# Altium schematic sheet FPGA.SchDoc
size A3; Organization: Blinkinlabs, LLC
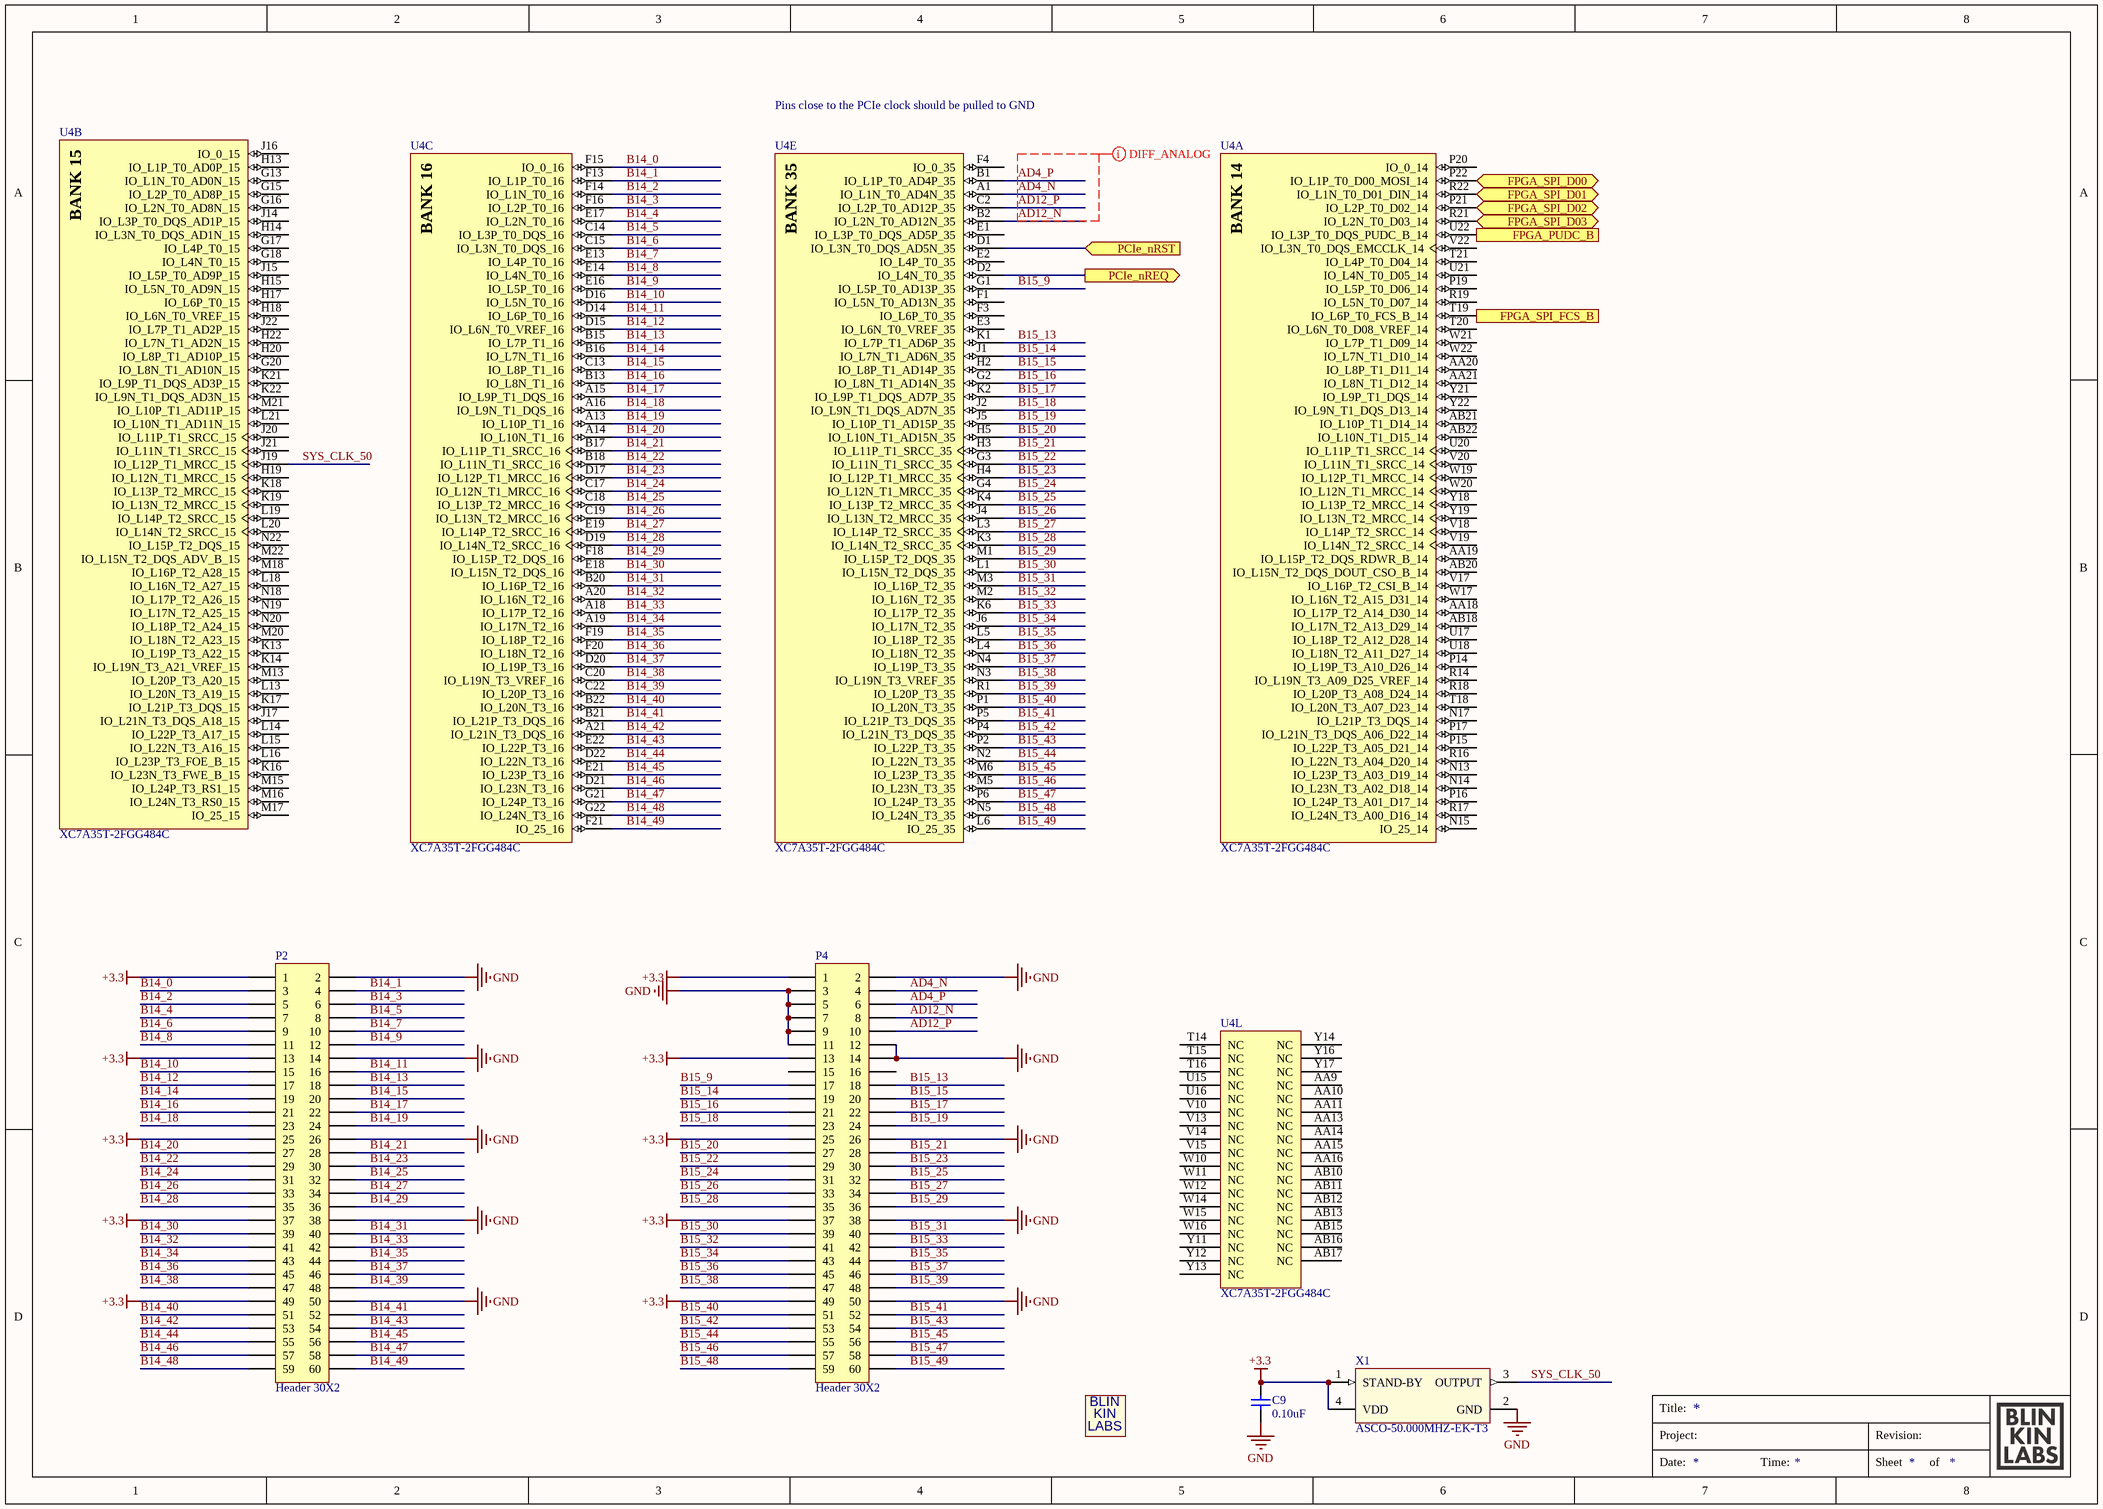
[diagram p0: FPGA.SchDoc]

## Parts
C9  0.10uF  [CAPC1005X06L]
L1  BLINKINLABS_LOGO  [BLINKINLABS_LOGO]  (value not drawn)  (no BOM)
P2  Header 30X2  [HDR2X30]
P4  Header 30X2  [HDR2X30]
U4  XC7A35T-2FGG484C  [FGG484]  (parts A,B,C,E,L of 12)
X1  ASCO-50.000MHZ-EK-T3  [ABRA-ASCO-50.000MHZ-EK-T3-4_V]

## Ports
FPGA_PUDC_B (in), FPGA_SPI_D00 (bidir), FPGA_SPI_D01 (bidir), FPGA_SPI_D02 (bidir), FPGA_SPI_D03 (bidir), FPGA_SPI_FCS_B (out), PCIe_nREQ (out), PCIe_nRST (in)

## Nets
+3.3: C9.2 P2.1 P2.13 P2.25 P2.37 P2.49 P4.1 P4.13 P4.25 P4.37 P4.49 X1.1(STAND-BY) X1.4(VDD)
GND: C9.1 P2.2 P2.14 P2.26 P2.38 P2.50 P4.2 P4.3 P4.5 P4.7 P4.9 P4.11 P4.12 P4.14 P4.26 P4.38 P4.50 X1.2(GND)
AD4_N: P4.4 U4.A1(IO_L1N_T0_AD4N_35)
AD4_P: P4.6 U4.B1(IO_L1P_T0_AD4P_35)
AD12_N: P4.8 U4.B2(IO_L2N_T0_AD12N_35)
AD12_P: P4.10 U4.C2(IO_L2P_T0_AD12P_35)
B14_0: P2.3 U4.F15(IO_0_16)
B14_1: P2.4 U4.F13(IO_L1P_T0_16)
B14_2: P2.5 U4.F14(IO_L1N_T0_16)
B14_3: P2.6 U4.F16(IO_L2P_T0_16)
B14_4: P2.7 U4.E17(IO_L2N_T0_16)
B14_5: P2.8 U4.C14(IO_L3P_T0_DQS_16)
B14_6: P2.9 U4.C15(IO_L3N_T0_DQS_16)
B14_7: P2.10 U4.E13(IO_L4P_T0_16)
B14_8: P2.11 U4.E14(IO_L4N_T0_16)
B14_9: P2.12 U4.E16(IO_L5P_T0_16)
B14_10: P2.15 U4.D16(IO_L5N_T0_16)
B14_11: P2.16 U4.D14(IO_L6P_T0_16)
B14_12: P2.17 U4.D15(IO_L6N_T0_VREF_16)
B14_13: P2.18 U4.B15(IO_L7P_T1_16)
B14_14: P2.19 U4.B16(IO_L7N_T1_16)
B14_15: P2.20 U4.C13(IO_L8P_T1_16)
B14_16: P2.21 U4.B13(IO_L8N_T1_16)
B14_17: P2.22 U4.A15(IO_L9P_T1_DQS_16)
B14_18: P2.23 U4.A16(IO_L9N_T1_DQS_16)
B14_19: P2.24 U4.A13(IO_L10P_T1_16)
B14_20: P2.27 U4.A14(IO_L10N_T1_16)
B14_21: P2.28 U4.B17(IO_L11P_T1_SRCC_16)
B14_22: P2.29 U4.B18(IO_L11N_T1_SRCC_16)
B14_23: P2.30 U4.D17(IO_L12P_T1_MRCC_16)
B14_24: P2.31 U4.C17(IO_L12N_T1_MRCC_16)
B14_25: P2.32 U4.C18(IO_L13P_T2_MRCC_16)
B14_26: P2.33 U4.C19(IO_L13N_T2_MRCC_16)
B14_27: P2.34 U4.E19(IO_L14P_T2_SRCC_16)
B14_28: P2.35 U4.D19(IO_L14N_T2_SRCC_16)
B14_29: P2.36 U4.F18(IO_L15P_T2_DQS_16)
B14_30: P2.39 U4.E18(IO_L15N_T2_DQS_16)
B14_31: P2.40 U4.B20(IO_L16P_T2_16)
B14_32: P2.41 U4.A20(IO_L16N_T2_16)
B14_33: P2.42 U4.A18(IO_L17P_T2_16)
B14_34: P2.43 U4.A19(IO_L17N_T2_16)
B14_35: P2.44 U4.F19(IO_L18P_T2_16)
B14_36: P2.45 U4.F20(IO_L18N_T2_16)
B14_37: P2.46 U4.D20(IO_L19P_T3_16)
B14_38: P2.47 U4.C20(IO_L19N_T3_VREF_16)
B14_39: P2.48 U4.C22(IO_L20P_T3_16)
B14_40: P2.51 U4.B22(IO_L20N_T3_16)
B14_41: P2.52 U4.B21(IO_L21P_T3_DQS_16)
B14_42: P2.53 U4.A21(IO_L21N_T3_DQS_16)
B14_43: P2.54 U4.E22(IO_L22P_T3_16)
B14_44: P2.55 U4.D22(IO_L22N_T3_16)
B14_45: P2.56 U4.E21(IO_L23P_T3_16)
B14_46: P2.57 U4.D21(IO_L23N_T3_16)
B14_47: P2.58 U4.G21(IO_L24P_T3_16)
B14_48: P2.59 U4.G22(IO_L24N_T3_16)
B14_49: P2.60 U4.F21(IO_25_16)
B15_9: P4.17 U4.G1(IO_L5P_T0_AD13P_35)
B15_13: P4.18 U4.K1(IO_L7P_T1_AD6P_35)
B15_14: P4.19 U4.J1(IO_L7N_T1_AD6N_35)
B15_15: P4.20 U4.H2(IO_L8P_T1_AD14P_35)
B15_16: P4.21 U4.G2(IO_L8N_T1_AD14N_35)
B15_17: P4.22 U4.K2(IO_L9P_T1_DQS_AD7P_35)
B15_18: P4.23 U4.J2(IO_L9N_T1_DQS_AD7N_35)
B15_19: P4.24 U4.J5(IO_L10P_T1_AD15P_35)
B15_20: P4.27 U4.H5(IO_L10N_T1_AD15N_35)
B15_21: P4.28 U4.H3(IO_L11P_T1_SRCC_35)
B15_22: P4.29 U4.G3(IO_L11N_T1_SRCC_35)
B15_23: P4.30 U4.H4(IO_L12P_T1_MRCC_35)
B15_24: P4.31 U4.G4(IO_L12N_T1_MRCC_35)
B15_25: P4.32 U4.K4(IO_L13P_T2_MRCC_35)
B15_26: P4.33 U4.J4(IO_L13N_T2_MRCC_35)
B15_27: P4.34 U4.L3(IO_L14P_T2_SRCC_35)
B15_28: P4.35 U4.K3(IO_L14N_T2_SRCC_35)
B15_29: P4.36 U4.M1(IO_L15P_T2_DQS_35)
B15_30: P4.39 U4.L1(IO_L15N_T2_DQS_35)
B15_31: P4.40 U4.M3(IO_L16P_T2_35)
B15_32: P4.41 U4.M2(IO_L16N_T2_35)
B15_33: P4.42 U4.K6(IO_L17P_T2_35)
B15_34: P4.43 U4.J6(IO_L17N_T2_35)
B15_35: P4.44 U4.L5(IO_L18P_T2_35)
B15_36: P4.45 U4.L4(IO_L18N_T2_35)
B15_37: P4.46 U4.N4(IO_L19P_T3_35)
B15_38: P4.47 U4.N3(IO_L19N_T3_VREF_35)
B15_39: P4.48 U4.R1(IO_L20P_T3_35)
B15_40: P4.51 U4.P1(IO_L20N_T3_35)
B15_41: P4.52 U4.P5(IO_L21P_T3_DQS_35)
B15_42: P4.53 U4.P4(IO_L21N_T3_DQS_35)
B15_43: P4.54 U4.P2(IO_L22P_T3_35)
B15_44: P4.55 U4.N2(IO_L22N_T3_35)
B15_45: P4.56 U4.M6(IO_L23P_T3_35)
B15_46: P4.57 U4.M5(IO_L23N_T3_35)
B15_47: P4.58 U4.P6(IO_L24P_T3_35)
B15_48: P4.59 U4.N5(IO_L24N_T3_35)
B15_49: P4.60 U4.L6(IO_25_35)
FPGA_PUDC_B: U4.U22(IO_L3P_T0_DQS_PUDC_B_14) ; port FPGA_PUDC_B
FPGA_SPI_D00: U4.P22(IO_L1P_T0_D00_MOSI_14) ; port FPGA_SPI_D00
FPGA_SPI_D01: U4.R22(IO_L1N_T0_D01_DIN_14) ; port FPGA_SPI_D01
FPGA_SPI_D02: U4.P21(IO_L2P_T0_D02_14) ; port FPGA_SPI_D02
FPGA_SPI_D03: U4.R21(IO_L2N_T0_D03_14) ; port FPGA_SPI_D03
FPGA_SPI_FCS_B: U4.T19(IO_L6P_T0_FCS_B_14) ; port FPGA_SPI_FCS_B
PCIe_nREQ: U4.D2(IO_L4N_T0_35) ; port PCIe_nREQ
PCIe_nRST: U4.D1(IO_L3N_T0_DQS_AD5N_35) ; port PCIe_nRST
SYS_CLK_50: U4.J19(IO_L12P_T1_MRCC_15) X1.3(OUTPUT)

Not connected (* = marked no-connect by the designer): P4 15 16; U4 AA9(NC) AA10(NC) AA11(NC) AA13(NC) AA14(NC) AA15(NC) AA16(NC) AA18(IO_L17P_T2_A14_D30_14) AA19(IO_L15P_T2_DQS_RDWR_B_14) AA20(IO_L8P_T1_D11_14) AA21(IO_L8N_T1_D12_14) AB10(NC) AB11(NC) AB12(NC) AB13(NC) AB15(NC) AB16(NC) AB17(NC) AB18(IO_L17N_T2_A13_D29_14) AB20(IO_L15N_T2_DQS_DOUT_CSO_B_14) AB21(IO_L10P_T1_D14_14) AB22(IO_L10N_T1_D15_14) E1(IO_L3P_T0_DQS_AD5P_35) E2(IO_L4P_T0_35) E3(IO_L6N_T0_VREF_35) F1(IO_L5N_T0_AD13N_35) F3(IO_L6P_T0_35) F4(IO_0_35) G13(IO_L1N_T0_AD0N_15) G15(IO_L2P_T0_AD8P_15) G16(IO_L2N_T0_AD8N_15) G17(IO_L4P_T0_15) G18(IO_L4N_T0_15) G20(IO_L8N_T1_AD10N_15) H13(IO_L1P_T0_AD0P_15) H14(IO_L3N_T0_DQS_AD1N_15) H15(IO_L5N_T0_AD9N_15) H17(IO_L6P_T0_15) H18(IO_L6N_T0_VREF_15) H19(IO_L12N_T1_MRCC_15) H20(IO_L8P_T1_AD10P_15) H22(IO_L7N_T1_AD2N_15) J14(IO_L3P_T0_DQS_AD1P_15) J15(IO_L5P_T0_AD9P_15) J16(IO_0_15) J17(IO_L21N_T3_DQS_A18_15) J20(IO_L11P_T1_SRCC_15) J21(IO_L11N_T1_SRCC_15) J22(IO_L7P_T1_AD2P_15) K13(IO_L19P_T3_A22_15) K14(IO_L19N_T3_A21_VREF_15) K16(IO_L23N_T3_FWE_B_15) K17(IO_L21P_T3_DQS_15) K18(IO_L13P_T2_MRCC_15) K19(IO_L13N_T2_MRCC_15) K21(IO_L9P_T1_DQS_AD3P_15) K22(IO_L9N_T1_DQS_AD3N_15) L13(IO_L20N_T3_A19_15) L14(IO_L22P_T3_A17_15) L15(IO_L22N_T3_A16_15) L16(IO_L23P_T3_FOE_B_15) L18(IO_L16N_T2_A27_15) L19(IO_L14P_T2_SRCC_15) L20(IO_L14N_T2_SRCC_15) L21(IO_L10N_T1_AD11N_15) M13(IO_L20P_T3_A20_15) M15(IO_L24P_T3_RS1_15) M16(IO_L24N_T3_RS0_15) M17(IO_25_15) M18(IO_L16P_T2_A28_15) M20(IO_L18N_T2_A23_15) M21(IO_L10P_T1_AD11P_15) M22(IO_L15N_T2_DQS_ADV_B_15) N13(IO_L23P_T3_A03_D19_14) N14(IO_L23N_T3_A02_D18_14) N15(IO_25_14) N17(IO_L21P_T3_DQS_14) N18(IO_L17P_T2_A26_15) N19(IO_L17N_T2_A25_15) N20(IO_L18P_T2_A24_15) N22(IO_L15P_T2_DQS_15) P14(IO_L19P_T3_A10_D26_14) P15(IO_L22P_T3_A05_D21_14) P16(IO_L24P_T3_A01_D17_14) P17(IO_L21N_T3_DQS_A06_D22_14) P19(IO_L5P_T0_D06_14) P20(IO_0_14) R14(IO_L19N_T3_A09_D25_VREF_14) R16(IO_L22N_T3_A04_D20_14) R17(IO_L24N_T3_A00_D16_14) R18(IO_L20P_T3_A08_D24_14) R19(IO_L5N_T0_D07_14) T14(NC) T15(NC) T16(NC) T18(IO_L20N_T3_A07_D23_14) T20(IO_L6N_T0_D08_VREF_14) T21(IO_L4P_T0_D04_14) U15(NC) U16(NC) U17(IO_L18P_T2_A12_D28_14) U18(IO_L18N_T2_A11_D27_14) U20(IO_L11P_T1_SRCC_14) U21(IO_L4N_T0_D05_14) V10(NC) V13(NC) V14(NC) V15(NC) V17(IO_L16P_T2_CSI_B_14) V18(IO_L14P_T2_SRCC_14) V19(IO_L14N_T2_SRCC_14) V20(IO_L11N_T1_SRCC_14) V22(IO_L3N_T0_DQS_EMCCLK_14) W10(NC) W11(NC) W12(NC) W14(NC) W15(NC) W16(NC) W17(IO_L16N_T2_A15_D31_14) W19(IO_L12P_T1_MRCC_14) W20(IO_L12N_T1_MRCC_14) W21(IO_L7P_T1_D09_14) W22(IO_L7N_T1_D10_14) Y11(NC) Y12(NC) Y13(NC) Y14(NC) Y16(NC) Y17(NC) Y18(IO_L13P_T2_MRCC_14) Y19(IO_L13N_T2_MRCC_14) Y21(IO_L9P_T1_DQS_14) Y22(IO_L9N_T1_DQS_D13_14)

## Layout directives
differential pair; differential pair class DIFF_100Ohm_HDMI; differential pair class DIFF_ANALOG; net class ANALOG: AD4_N, AD4_P, AD12_N, AD12_P

## Notes on the sheet
- Pins close to the PCIe clock should be pulled to GND
- Title:
- Project:
- Revision:
- Date:
- Time:
- Sheet
- of
- (in symbol BLINKINLABS_LOGO) BLIN; KIN; LABS
- (in symbol CMP-0383-00019-1, part A) BANK 14
- (in symbol CMP-0383-00019-1, part B) BANK 15
- (in symbol CMP-0383-00019-1, part C) BANK 16
- (in symbol CMP-0383-00019-1, part E) BANK 35

## Library data of the parts
C9 = GRM155R61A104KA01D: CAP CER 0.1UF 10V X5R 0402; Manufacturer: Murata Electronics North America; Tolerance: ±10%; PartNumber: GRM155R61A104KA01D; Datasheets: http://www.murata.com/~/media/webrenewal/support/library/catalog/products/capacitor/mlcc/c02e.pdf; Image: //media.digikey.com/Renders/Murata%20Renders/ZRB-SERIES-0402.jpg; Digi-Key Part Number: 490-1318-1-ND; Packaging: Cut Tape (CT); Series: GRM; Value: 0.10uF; Voltage: 10V; Temperature Coefficient: X5R; Operating Temperature: -55°C ~ 85°C; Features: -; Applications: General Purpose; Package / Case: 0402 (1005 Metric); Case/Package: 0402
L1 = BLINKINLABS_LOGO: Square logo
P2 P4 = Header 30X2: Header, 30-Pin, Dual row; LatestRevisionDate: 17-Jul-2002; LatestRevisionNote: Re-released for DXP Platform.; Publisher: Altium Limited
U4 = CMP-0383-00019-1: Artix-7 FPGA, 250 User I/Os, 4 GTP, 484-Ball BGA, Speed Grade 2, Commercial Grade, Pb-Free; Manufacturer: Xilinx; Total Block RAM: 1800 Kb; GTP: 4; Available User I/O: 250; Speed Grades: 2; Logic Cells: 33280; CMTs: 5; ComponentLink3URL: http://www.xilinx.com/support/documentation/user_guides/ug475_7Series_Pkg_Pinout.pdf; PackageVersion: Rev. 1.11; ComponentLink2Description: Datasheet; ComponentLink3Description: Pinout; PartNumber: XC7A35T-2FGG484C; DatasheetVersion: Rev. 1.15; Operating Temperature Range: Commercial; PackageDescription: 484-Ball Wire-Bond Fine-Pitch BGA, Body 23 x 23 mm, Pitch 1 mm; ComponentLink4Description: Package Specification; Maximum Distributed RAM: 400 Kb; Mounting Technology: Surface Mount; ComponentLink2URL: http://www.xilinx.com/support/documentation/data_sheets/ds180_7Series_Overview.pdf; ComponentLink1Description: Manufacturer URL; ComponentLink4URL: http://www.xilinx.com/support/documentation/user_guides/ug475_7Series_Pkg_Pinout.pdf; PackageReference: FGG484; ComponentLink1URL: http://www.xilinx.com/
X1 = CMP-0461-00001-3: Crystal Clock Oscillator, 50 MHz, -20 to 70 degC, 1.6 x 1.2 x 0.7 mm SMD; Manufacturer: Abracon; Frequency(MHz): 50; Aging: -3 to 3 3 ppm; Packing: Tape and Reel; Overall Frequency Stability: +/-30 ppm; Supply Current (Idd)
into 15pF Load: 6 mA; Supply Voltage (Vdd): 3.3 V; Output Load: 15 pF; ComponentLink2Description: Datasheet; ComponentLink3Description: Package Specification; ComponentLink3URL: http://www.abracon.com/Oscillators/ASCO.pdf; ComponentLink2URL: http://www.abracon.com/Oscillators/ASCO.pdf; Mounting Technology: Surface Mount; PackageDescription: 4-Pin Hand Drawn, Body 1.6 x 1.2 mm; DatasheetVersion: 01.25.13; ComponentLink1Description: Manufacturer URL; PartNumber: ASCO-50.000MHZ-EK-T3; Operating temperature: -20 to 70 degC; ComponentLink1URL: http://www.abracon.com; PackageReference: ASCO-50.000MHZ-EK-T3-4